# EAGLE schematic EdiBot_Block_Diagram (EAGLE 7.2.0)
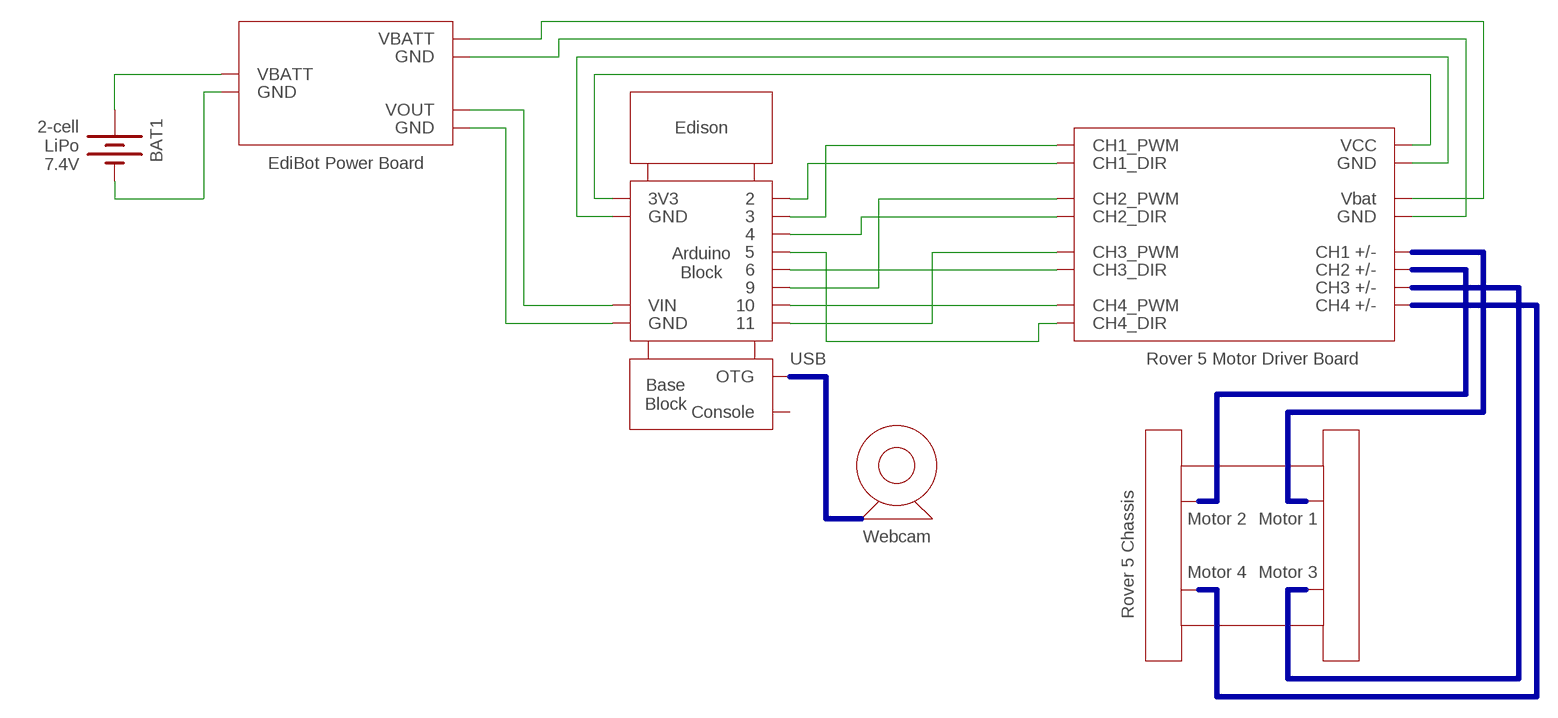
[diagram p0: schematic, sheet 1]

## Parts
BAT1  BATTERYAA  [BATTERY-AA]

## Nets
N$1: BAT1.PWR@1(+)
N$16: BAT1.GND@1(-)

## Buses
B$1
B$2
B$3
B$4
B$5

## Notes on the sheet
- VBATT
- GND
- VBATT
- GND
- VOUT
- GND | Edison
- 2-cell
  LiPo
  7.4V
- CH1_PWM | VCC
- EdiBot Power Board | CH1_DIR | GND
- 3V3 | 2 | CH2_PWM | Vbat
- GND | 3 | CH2_DIR | GND
- 4
- 5 | CH3_PWM | CH1 +/-
- Arduino
  Block
- 6 | CH3_DIR | CH2 +/-
- 9 | CH3 +/-
- VIN | 10 | CH4_PWM | CH4 +/-
- GND | 11 | CH4_DIR
- USB | Rover 5 Motor Driver Board
- OTG
- Base
  Block
- Console
- Motor 2 | Motor 1
- Webcam
- Rover 5 Chassis
- Motor 4 | Motor 3

## Library data of the parts
BAT1 = SparkFun-Electromechanical:BATTERY: Battery Holders Various common sizes : AA, AAA, 18650 (PRT-12895), 20mm coin cell and 12mm coin cell. 20MM_4LEGS, BATT-10373